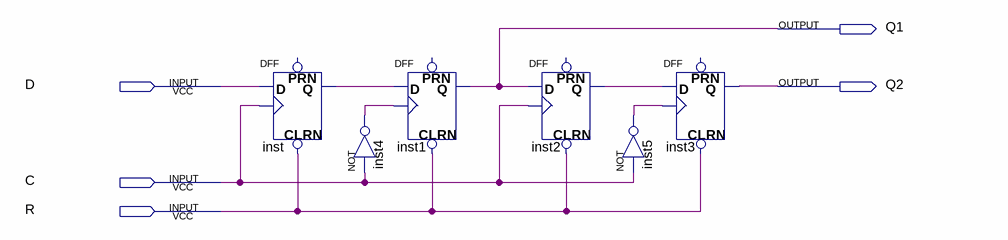
[diagram p0: schematic sheet]
// Quartus schematic point2.bdf as structural Verilog: 6 symbols, 5 pins
module point2 (
  input  D,
  input  C,
  input  R,
  output Q1,
  output Q2
);

  wire inst2_q, inst4_out, inst5_out, inst_q;

  DFF inst (.CLRN(R), .CLK(C), .D(D), .Q(inst_q));  // open: PRN
  not inst4 (inst4_out, C);
  DFF inst1 (.CLRN(R), .CLK(inst4_out), .D(inst_q), .Q(Q1));  // open: PRN
  DFF inst2 (.CLRN(R), .CLK(C), .D(Q1), .Q(inst2_q));  // open: PRN
  DFF inst3 (.CLRN(R), .CLK(inst5_out), .D(inst2_q), .Q(Q2));  // open: PRN
  not inst5 (inst5_out, C);
endmodule
